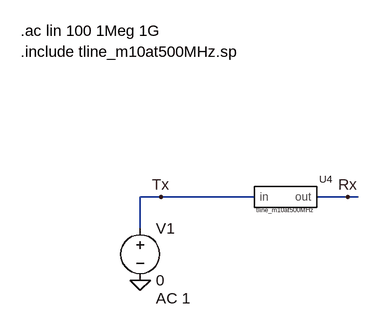
[diagram p0: schematic Channel_model_500MHz_AC.asc]
Channel_model_500MHz_AC.asc, the LTspice schematic file:
Version 4.1
SHEET 1 880 680
WIRE 80 64 48 64
WIRE 224 64 80 64
WIRE 368 64 320 64
WIRE 384 64 368 64
WIRE 48 112 48 64
FLAG 48 192 0
FLAG 80 64 Tx
FLAG 368 64 Rx
SYMBOL voltage 48 96 R0
WINDOW 123 24 124 Left 2
WINDOW 39 0 0 Left 0
SYMATTR Value2 AC 1
SYMATTR InstName V1
SYMATTR Value 0
SYMBOL channel 272 64 R0
SYMATTR SpiceModel tline_m10at500MHz
SYMATTR InstName U4
TEXT -136 -192 Left 2 !.ac lin 100 1Meg 1G
TEXT -136 -160 Left 2 !.include tline_m10at500MHz.sp

The netlist it stands for:
* Channel_model_500MHz_AC.asc
V1 Tx 0 0 AC 1
X§U4 Tx Rx tline_m10at500MHz  ; pins in out
.ac lin 100 1Meg 1G
.include tline_m10at500MHz.sp
.backanno
.end